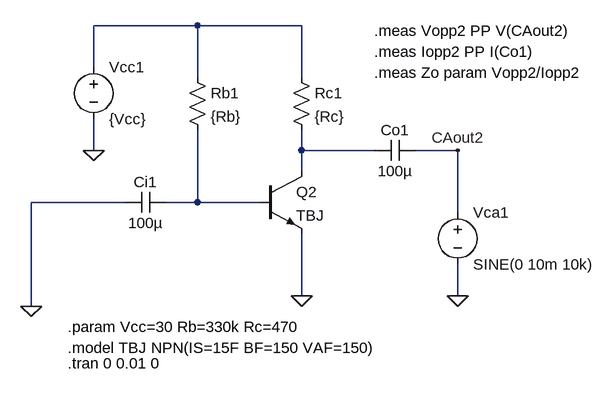
[diagram p0: schematic TBJ01CAZo.asc]
TBJ01CAZo.asc, the LTspice schematic file:
Version 4
SHEET 1 1656 1016
WIRE 880 480 720 480
WIRE 1040 480 880 480
WIRE 720 544 720 480
WIRE 880 560 880 480
WIRE 1040 560 1040 480
WIRE 720 672 720 624
WIRE 1040 672 1040 640
WIRE 1152 672 1040 672
WIRE 1280 672 1216 672
WIRE 1040 704 1040 672
WIRE 768 752 624 752
WIRE 880 752 880 640
WIRE 880 752 832 752
WIRE 976 752 880 752
WIRE 1280 768 1280 672
WIRE 1040 896 1040 800
WIRE 1280 896 1280 848
WIRE 624 912 624 752
FLAG 720 672 0
FLAG 1040 896 0
FLAG 624 912 0
FLAG 1280 896 0
FLAG 1280 672 CAout2
SYMBOL res 864 544 R0
SYMATTR InstName Rb1
SYMATTR Value {Rb}
SYMBOL res 1024 544 R0
SYMATTR InstName Rc1
SYMATTR Value {Rc}
SYMBOL voltage 720 528 R0
WINDOW 123 0 0 Left 0
WINDOW 39 0 0 Left 0
SYMATTR InstName Vcc1
SYMATTR Value {Vcc}
SYMBOL npn 976 704 R0
SYMATTR InstName Q2
SYMATTR Value TBJ
SYMBOL cap 832 736 R90
WINDOW 0 0 32 VBottom 2
WINDOW 3 32 32 VTop 2
SYMATTR InstName Ci1
SYMATTR Value 100µ
SYMBOL cap 1216 656 R90
WINDOW 0 0 32 VBottom 2
WINDOW 3 32 32 VTop 2
SYMATTR InstName Co1
SYMATTR Value 100µ
SYMBOL voltage 1280 752 R0
WINDOW 123 0 0 Left 0
WINDOW 39 0 0 Left 0
SYMATTR InstName Vca1
SYMATTR Value SINE(0 10m 10k)
TEXT 680 1000 Left 2 !.tran 0 0.01 0
TEXT 680 944 Left 2 !.param Vcc=30 Rb=330k Rc=470
TEXT 680 976 Left 2 !.model TBJ NPN(IS=15F BF=150 VAF=150)
TEXT 1152 488 Left 2 !.meas Vopp2 PP V(CAout2)
TEXT 1152 520 Left 2 !.meas Iopp2 PP I(Co1)
TEXT 1152 552 Left 2 !.meas Zo param Vopp2/Iopp2

The netlist it stands for:
* TBJ01CAZo.asc
Rb1 N001 N003 {Rb}
Rc1 N001 N002 {Rc}
Vcc1 N001 0 {Vcc}
Q2 N002 N003 0 0 TBJ
Ci1 N003 0 100µ
Co1 CAout2 N002 100µ
Vca1 CAout2 0 SINE(0 10m 10k)
.model NPN NPN
.model PNP PNP
.lib standard.bjt
.tran 0 0.01 0
.param Vcc=30 Rb=330k Rc=470
.model TBJ NPN(IS=15F BF=150 VAF=150)
.meas Vopp2 PP V(CAout2)
.meas Iopp2 PP I(Co1)
.meas Zo param Vopp2/Iopp2
.backanno
.end